# EAGLE design BareBones Arduino No Multiplexer (EAGLE 8.4.1)
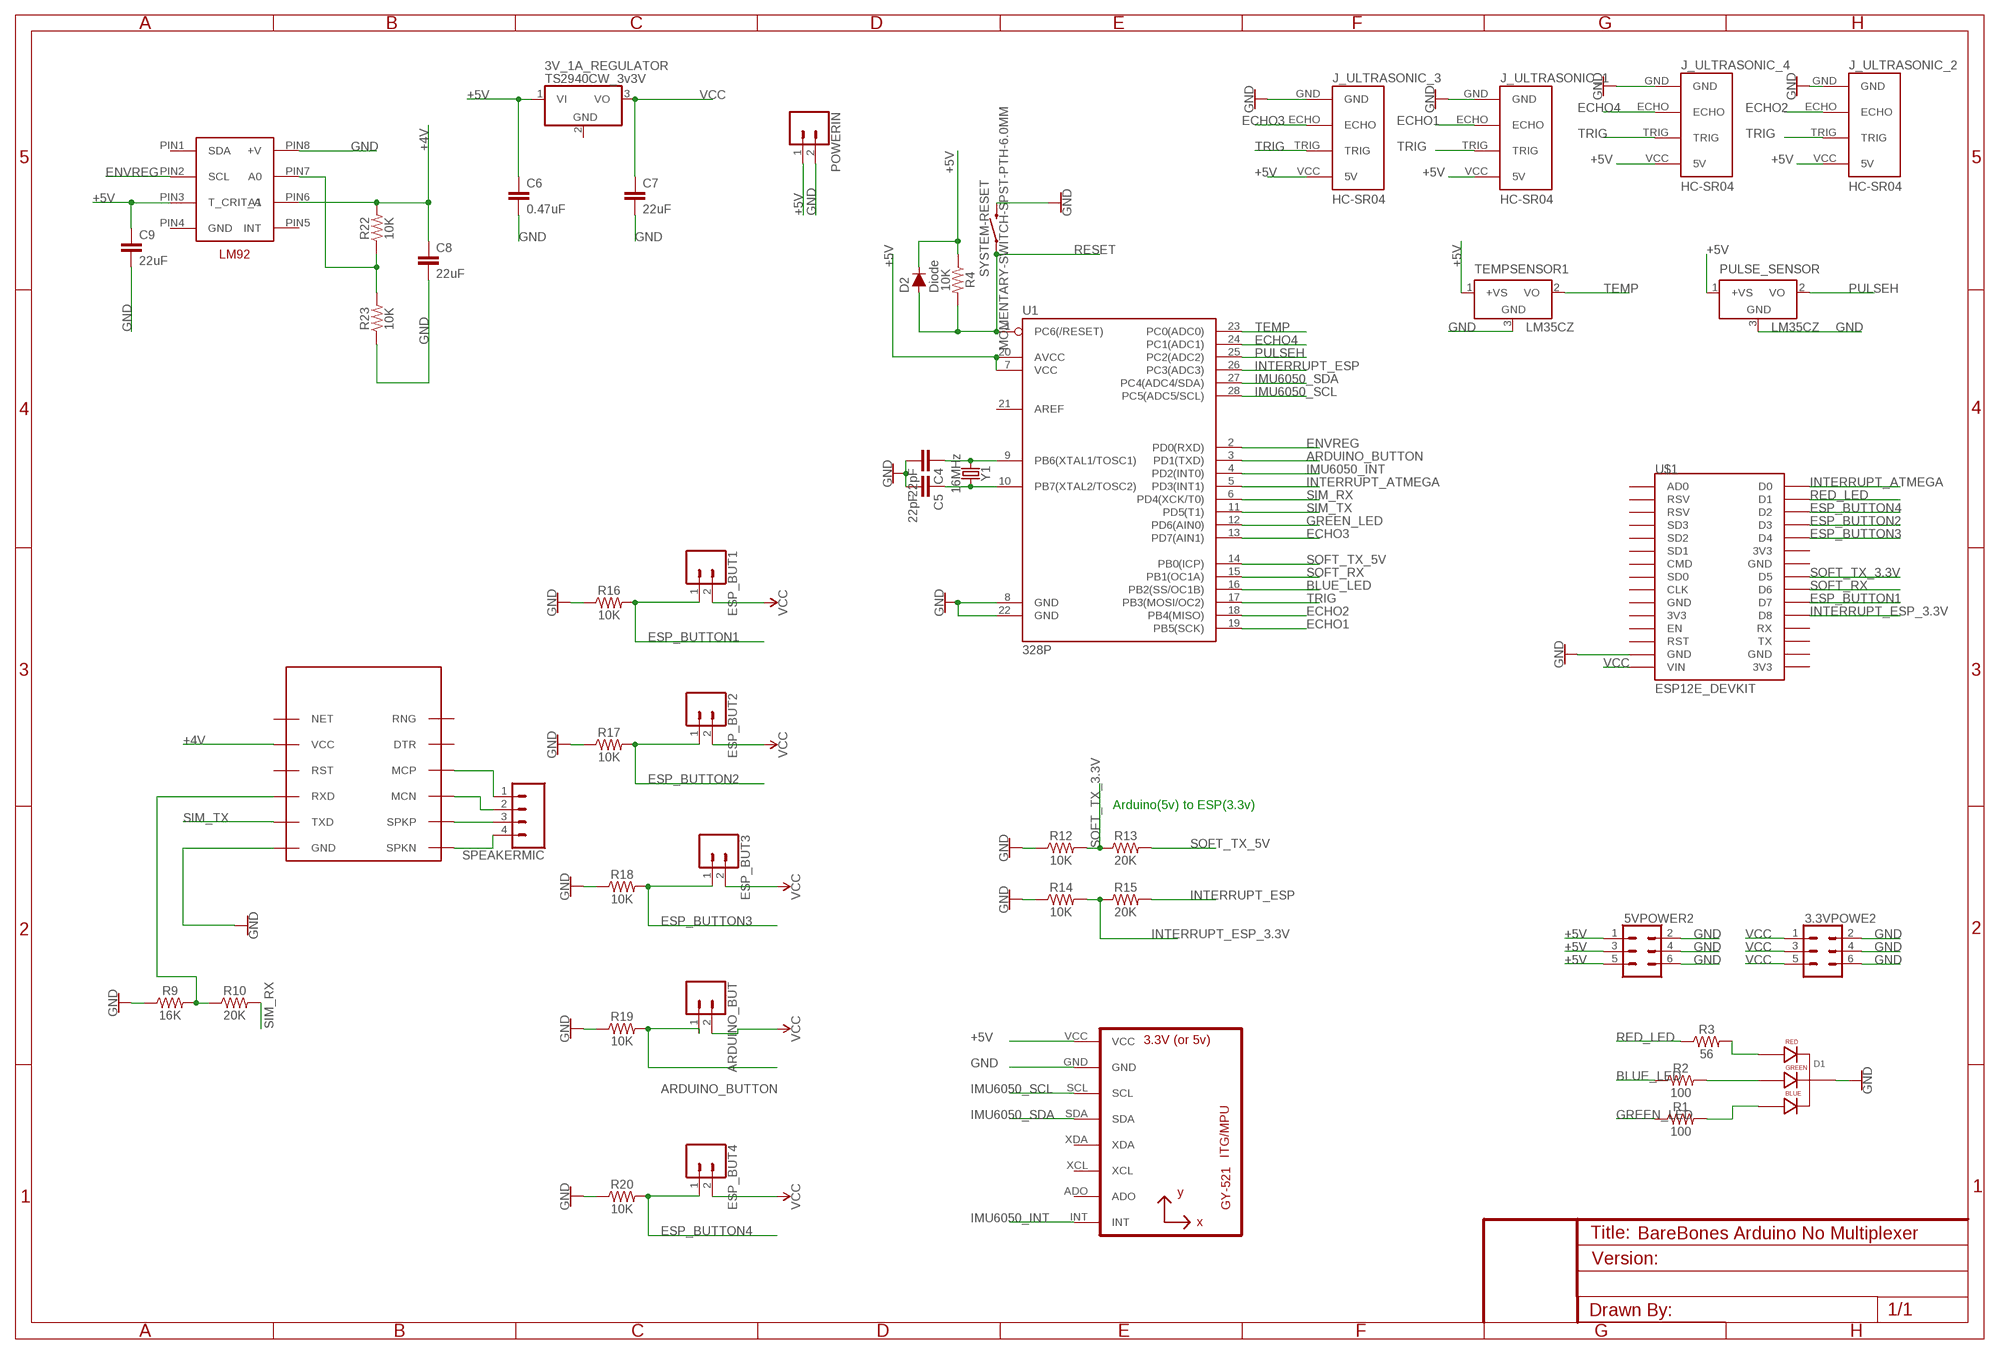
[diagram p0: schematic, sheet 1]

## Parts
3.3VPOWE2  CONN_03X2FEMALE  [2X3]
3V_1A_REGULATOR  TS2940CW_3v3V  MCP1703DB  [SOT223]
5VPOWER2  CONN_03X2FEMALE  [2X3]
ARDUINO_BUT  CONN_02  [1X02]
C4  22pF  22PF-PTH-2.54MM-200V-5%  [CAP-PTH-2.54]
C5  22pF  22PF-PTH-2.54MM-200V-5%  [CAP-PTH-2.54]
C6  0.47uF  0.1UF-KIT-EZ-50V-20%  [CAP-PTH-SMALL-KIT]
C7  22uF  0.1UF-KIT-EZ-50V-20%  [CAP-PTH-SMALL-KIT]
C8  22uF  0.1UF-KIT-EZ-50V-20%  [CAP-PTH-SMALL-KIT]
C9  22uF  0.1UF-KIT-EZ-50V-20%  [CAP-PTH-SMALL-KIT]
D1  LED-RGB-CC-THRUDIFFUSE  [LED-RGB-THRU]
D2  Diode  DIODE-1N4148  [DIODE-1N4148]
ESP_BUT1  CONN_02  [1X02]
ESP_BUT2  CONN_02  [1X02]
ESP_BUT3  CONN_02  [1X02]
ESP_BUT4  CONN_02  [1X02]
J_ULTRASONIC_1  HC-SR04  [HC-SR04_FOOTPRINT]
J_ULTRASONIC_2  HC-SR04  [HC-SR04_FOOTPRINT]
J_ULTRASONIC_3  HC-SR04  [HC-SR04_FOOTPRINT]
J_ULTRASONIC_4  HC-SR04  [HC-SR04_FOOTPRINT]
POWERIN  CONN_025MM  [SCREWTERMINAL-5MM-2]
PULSE_SENSOR  LM35CZ  [TO92]
R1  100  100OHM-HORIZ-1/4W-1%  [AXIAL-0.3]
R2  100  100OHM-HORIZ-1/4W-1%  [AXIAL-0.3]
R3  56  RESISTORAXIAL-0.3  [AXIAL-0.3]
R4  10K  100OHM-HORIZ-1/4W-1%  [AXIAL-0.3]
R9  16K  100OHM-HORIZ-1/4W-1%  [AXIAL-0.3]
R10  20K  100OHM-HORIZ-1/4W-1%  [AXIAL-0.3]
R12  10K  100OHM-HORIZ-1/4W-1%  [AXIAL-0.3]
R13  20K  100OHM-HORIZ-1/4W-1%  [AXIAL-0.3]
R14  10K  100OHM-HORIZ-1/4W-1%  [AXIAL-0.3]
R15  20K  100OHM-HORIZ-1/4W-1%  [AXIAL-0.3]
R16  10K  100OHM-HORIZ-1/4W-1%  [AXIAL-0.3]
R17  10K  100OHM-HORIZ-1/4W-1%  [AXIAL-0.3]
R18  10K  100OHM-HORIZ-1/4W-1%  [AXIAL-0.3]
R19  10K  100OHM-HORIZ-1/4W-1%  [AXIAL-0.3]
R20  10K  100OHM-HORIZ-1/4W-1%  [AXIAL-0.3]
R22  10K  100OHM-HORIZ-1/4W-1%  [AXIAL-0.3]
R23  10K  100OHM-HORIZ-1/4W-1%  [AXIAL-0.3]
SPEAKERMIC  CONN_04  [1X04]
SYSTEM-RESET  MOMENTARY-SWITCH-SPST-PTH-6.0MM  [TACTILE_SWITCH_PTH_6.0MM]
TEMPSENSOR1  LM35CZ  [TO92]
U1  328P  ATMEGA328P_PDIP  [DIP28]
U2  GY-521MPU6050  [GY-521]
U$1  ESP12E_DEVKIT  [ESP12E_DEVKIT]
U$4  SIM800L  [SIM-CORE]
VREG  LM92  [SOP-8]
Y1  16MHz  CRYSTAL-16MHZPTH-HC49US  [HC49US]

## Nets
+4V: C8.1 R22.P$2 U$4.VCC VREG.PIN6(A1)
+5V: 3V_1A_REGULATOR.1(VI) 5VPOWER2.1 5VPOWER2.3 5VPOWER2.5 C6.1 C9.1 D2.C J_ULTRASONIC_1.VCC(5V) J_ULTRASONIC_2.VCC(5V) J_ULTRASONIC_3.VCC(5V) J_ULTRASONIC_4.VCC(5V) POWERIN.1 PULSE_SENSOR.1(+VS) R4.P$1 TEMPSENSOR1.1(+VS) U1.7(VCC) U1.20(AVCC) U2.VCC VREG.PIN3(T_CRIT_A)
ARDUINO_BUTTON: ARDUINO_BUT.1 R19.P$2 U1.3(PD1(TXD))
BLUE_LED: R2.P$1 U1.16(PB2(SS/OC1B))
ECHO1: J_ULTRASONIC_1.ECHO U1.19(PB5(SCK))
ECHO2: J_ULTRASONIC_2.ECHO U1.18(PB4(MISO))
ECHO3: J_ULTRASONIC_3.ECHO U1.13(PD7(AIN1))
ECHO4: J_ULTRASONIC_4.ECHO U1.24(PC1(ADC1))
ENVREG: U1.2(PD0(RXD)) VREG.PIN2(SCL)
ESP_BUTTON1: ESP_BUT1.1 R16.P$2 U$1.D7
ESP_BUTTON2: ESP_BUT2.1 R17.P$2 U$1.D3
ESP_BUTTON3: ESP_BUT3.1 R18.P$2 U$1.D4
ESP_BUTTON4: ESP_BUT4.1 R20.P$2 U$1.D2
GND: 3.3VPOWE2.2 3.3VPOWE2.4 3.3VPOWE2.6 5VPOWER2.2 5VPOWER2.4 5VPOWER2.6 C4.2 C5.2 C6.2 C7.2 C8.2 C9.2 D1.2(CATHODE) J_ULTRASONIC_1.GND J_ULTRASONIC_2.GND J_ULTRASONIC_3.GND J_ULTRASONIC_4.GND POWERIN.2 PULSE_SENSOR.3(GND) R9.P$1 R12.P$1 R14.P$1 R16.P$1 R17.P$1 R18.P$1 R19.P$1 R20.P$1 R23.P$1 SYSTEM-RESET.3 TEMPSENSOR1.3(GND) U1.8(GND) U1.22(GND) U2.GND U$1.GND@1(GND) U$4.GND VREG.PIN8(+V)
GREEN_LED: R1.P$1 U1.12(PD6(AIN0))
IMU6050_INT: U1.4(PD2(INT0)) U2.INT
IMU6050_SCL: U1.28(PC5(ADC5/SCL)) U2.SCL
IMU6050_SDA: U1.27(PC4(ADC4/SDA)) U2.SDA
INTERRUPT_ATMEGA: U1.5(PD3(INT1)) U$1.D0
INTERRUPT_ESP: R15.P$2 U1.26(PC3(ADC3))
INTERRUPT_ESP_3.3V: R14.P$2 R15.P$1 U$1.D8
N$1: C5.1 U1.10(PB7(XTAL2/TOSC2)) Y1.2
N$2: D1.1(RED_CATHODE) R3.P$2
N$3: D1.3(GREEN_CATHODE) R2.P$2
N$4: D1.4(BLUE_CATHODE) R1.P$2
N$5: SPEAKERMIC.1 U$4.MCP
N$7: SPEAKERMIC.2 U$4.MCN
N$8: C4.1 U1.9(PB6(XTAL1/TOSC1)) Y1.1
N$9: SPEAKERMIC.3 U$4.SPKP
N$10: SPEAKERMIC.4 U$4.SPKN
N$11: R9.P$2 R10.P$1 U$4.RXD
N$16: R22.P$1 R23.P$2 VREG.PIN7(A0)
PULSEH: PULSE_SENSOR.2(VO) U1.25(PC2(ADC2))
RED_LED: R3.P$1 U$1.D1
RESET: D2.A R4.P$2 SYSTEM-RESET.1 U1.1(PC6(/RESET))
SIM_RX: R10.P$2 U1.6(PD4(XCK/T0))
SIM_TX: U1.11(PD5(T1)) U$4.TXD
SOFT_RX: U1.15(PB1(OC1A)) U$1.D6
SOFT_TX_3.3V: R12.P$2 R13.P$1 U$1.D5
SOFT_TX_5V: R13.P$2 U1.14(PB0(ICP))
TEMP: TEMPSENSOR1.2(VO) U1.23(PC0(ADC0))
TRIG: J_ULTRASONIC_1.TRIG J_ULTRASONIC_2.TRIG J_ULTRASONIC_3.TRIG J_ULTRASONIC_4.TRIG U1.17(PB3(MOSI/OC2))
VCC: 3.3VPOWE2.1 3.3VPOWE2.3 3.3VPOWE2.5 3V_1A_REGULATOR.3(VO) ARDUINO_BUT.2 C7.1 ESP_BUT1.2 ESP_BUT2.2 ESP_BUT3.2 ESP_BUT4.2 U$1.VIN
Unconnected: 3V_1A_REGULATOR.2(GND) U1.21(AREF) U2.ADO U2.XCL U2.XDA U$1.3V3@0(3V3) U$1.3V3@1(3V3) U$1.3V3@2(3V3) U$1.AD0 U$1.CLK U$1.CMD U$1.EN U$1.GND@0(GND) U$1.GND@2(GND) U$1.GND@3(GND) U$1.RST U$1.RSV@0(RSV) U$1.RSV@1(RSV) U$1.RX U$1.SD0 U$1.SD1 U$1.SD2 U$1.SD3 U$1.TX U$4.DTR U$4.NET U$4.RNG U$4.RST VREG.PIN1(SDA) VREG.PIN4(GND) VREG.PIN5(INT)

## Notes on the sheet
- Arduino(5v) to ESP(3.3v)

## Library data of the parts
3.3VPOWE2 5VPOWER2 = SparkFun-Connectors:CONN_03X2: Multi connection point. Often used as Generic Header-pin footprint for 0.1 inch spaced/style header connections You can populate with any combo of single row headers, but if you'd like an exact match, check these: Header - 2x3 (Male, 0.1") <https://www.sparkfun.com/products/12807> (PRT-12807) Header - 2x3 (Female, 0.1") <https://www.sparkfun.com/products/13010> (PRT-13010) 2x3 Pin Shrouded Header <https://www.sparkfun.com/products/10877> (PRT-10877) On any of the 0.1 inch spaced packages, you can populate with these: Break Away Headers - Straight <https://www.sparkfun.com/products/116> (PRT-00116) Break Away Male Headers - Right Angle <https://www.sparkfun.com/products/553> (PRT-00553) Female Headers <https://www.sparkfun.com/products/115> (PRT-00115) Break Away Headers - Machine Pin <https://www.sparkfun.com/products/117> (PRT-00117) Break Away Female Headers - Swiss Machine Pin <https://www.sparkfun.com/products/743> (PRT-00743) Special note: the shrouded connector mates well with our 3x2 ribbon cables: Ribbon Crimp Connector - 6-pin (2x3, Female) <https://www.sparkfun.com/products/10651> (PRT-10651) Ribbon Cable - 6 wire (15ft) <https://www.sparkfun.com/products/10646> (PRT-10646); PROD_ID: CONN-11566; VALUE: FEMALE 2x3
3V_1A_REGULATOR = linear:MCP1703: 250 mA, 16V, Low Quiescent Current LDO Regulator Source: http://ww1.microchip.com/downloads/en/DeviceDoc/22049b.pdf
ARDUINO_BUT ESP_BUT1-ESP_BUT4 = SparkFun-Connectors:CONN_02: Multi connection point. Often used as Generic Header-pin footprint for 0.1 inch spaced/style header connections On any of the 0.1 inch spaced packages, you can populate with these: Break Away Headers - Straight <https://www.sparkfun.com/products/116> (PRT-00116) Break Away Male Headers - Right Angle <https://www.sparkfun.com/products/553> (PRT-00553) Female Headers <https://www.sparkfun.com/products/115> (PRT-00115) Break Away Headers - Machine Pin <https://www.sparkfun.com/products/117> (PRT-00117) Break Away Female Headers - Swiss Machine Pin <https://www.sparkfun.com/products/743> (PRT-00743) For SCREWTERMINALS and SPRING TERMINALS visit here: Screw Terimnals on SparkFun.com <https://www.sparkfun.com/search/results?term=Screw+Terminals> (5mm/3.5mm/2.54mm spacing) This device is also useful as a general connection point to wire up your design to another part of your project. Our various solder wires solder well into these plated through hole pads. Hook-Up Wire - Assortment (Stranded, 22 AWG) <https://www.sparkfun.com/products/11375> (PRT-11375) Hook-Up Wire - Assortment (Solid Core, 22 AWG) <https://www.sparkfun.com/products/11367> (PRT-11367) View the entire wire category on our website here <https://www.sparkfun.com/categories/141> Special notes: Molex polarized connector foot print use with: PRT-08233 with associated crimp pins and housings. 2.54_SCREWTERM for use with PRT-10571. 3.5mm Screw Terminal footprints for PRT-08084 5mm Screw Terminal footprints for use with PRT-08432
C4 C5 = SparkFun-Capacitors:22PF: 22pF ceramic capacitors A capacitor is a passive two-terminal electrical component used to store electrical energy temporarily in an electric field.; PROD_ID: CAP-09128
C6-C9 = SparkFun-Capacitors:0.1UF: 0.1µF ceramic capacitors A capacitor is a passive two-terminal electrical component used to store electrical energy temporarily in an electric field.; PROD_ID: CAP-08370; VALUE: 0.1uF
D1 = led:LED-RGB-CC-THRU: RGB Through-hole common cathode LED SparkFun Storefront: COM-00105 (Clear) COM-09264 (Diffuse); PROD_ID: DIO-09434
D2 = SparkFun-DiscreteSemi:DIODE: Diode These are standard reverse protection diodes and small signal diodes. SparkFun Products: SparkFun SparkPunk Sound Kit <https://www.sparkfun.com/products/11177> SparkFun ESP8266 Thing <https://www.sparkfun.com/products/13231>; PROD_ID: DIO-08378; VALUE: 200mA/100V/1V
J_ULTRASONIC_1-J_ULTRASONIC_4 = UltraSonic Sensor:HC-SR04: Ultrasonic Sensor HC-SR04
POWERIN = SparkFun-Connectors:CONN_02: Multi connection point. Often used as Generic Header-pin footprint for 0.1 inch spaced/style header connections On any of the 0.1 inch spaced packages, you can populate with these: Break Away Headers - Straight <https://www.sparkfun.com/products/116> (PRT-00116) Break Away Male Headers - Right Angle <https://www.sparkfun.com/products/553> (PRT-00553) Female Headers <https://www.sparkfun.com/products/115> (PRT-00115) Break Away Headers - Machine Pin <https://www.sparkfun.com/products/117> (PRT-00117) Break Away Female Headers - Swiss Machine Pin <https://www.sparkfun.com/products/743> (PRT-00743) For SCREWTERMINALS and SPRING TERMINALS visit here: Screw Terimnals on SparkFun.com <https://www.sparkfun.com/search/results?term=Screw+Terminals> (5mm/3.5mm/2.54mm spacing) This device is also useful as a general connection point to wire up your design to another part of your project. Our various solder wires solder well into these plated through hole pads. Hook-Up Wire - Assortment (Stranded, 22 AWG) <https://www.sparkfun.com/products/11375> (PRT-11375) Hook-Up Wire - Assortment (Solid Core, 22 AWG) <https://www.sparkfun.com/products/11367> (PRT-11367) View the entire wire category on our website here <https://www.sparkfun.com/categories/141> Special notes: Molex polarized connector foot print use with: PRT-08233 with associated crimp pins and housings. 2.54_SCREWTERM for use with PRT-10571. 3.5mm Screw Terminal footprints for PRT-08084 5mm Screw Terminal footprints for use with PRT-08432; SF_SKU: PRT-08432
PULSE_SENSOR TEMPSENSOR1 = lm35:LM35: Single-Supply Centigrade Temperature Sensor Vout = (10mV/°C x Temp °C) +5mmmV Source: http://www.national.com/ds/LM/LM35.pdf
R1 R2 = SparkFun-Resistors:100OHM: 100Ω resistor A resistor is a passive two-terminal electrical component that implements electrical resistance as a circuit element. Resistors act to reduce current flow, and, at the same time, act to lower voltage levels within circuits. - Wikipedia; PROD_ID: RES-12181
R3 = SparkFun-Resistors:RESISTOR: Generic Resistor Package
R4 R9 R10 R12-R20 R22 R23 = SparkFun-Resistors:100OHM: 100Ω resistor A resistor is a passive two-terminal electrical component that implements electrical resistance as a circuit element. Resistors act to reduce current flow, and, at the same time, act to lower voltage levels within circuits. - Wikipedia; PROD_ID: RES-12181; VALUE: 100
SPEAKERMIC = SparkFun-Connectors:CONN_04: Multi connection point. Often used as Generic Header-pin footprint for 0.1 inch spaced/style header connections On any of the 0.1 inch spaced packages, you can populate with these: Break Away Headers - Straight <https://www.sparkfun.com/products/116> (PRT-00116) Break Away Male Headers - Right Angle <https://www.sparkfun.com/products/553> (PRT-00553) Female Headers <https://www.sparkfun.com/products/115> (PRT-00115) Break Away Headers - Machine Pin <https://www.sparkfun.com/products/117> (PRT-00117) Break Away Female Headers - Swiss Machine Pin <https://www.sparkfun.com/products/743> (PRT-00743) For SCREWTERMINALS and SPRING TERMINALS visit here: Screw Terimnals on SparkFun.com <https://www.sparkfun.com/search/results?term=Screw+Terminals> (5mm/3.5mm/2.54mm spacing) This device is also useful as a general connection point to wire up your design to another part of your project. Our various solder wires solder well into these plated through hole pads. Hook-Up Wire - Assortment (Stranded, 22 AWG) <https://www.sparkfun.com/products/11375> (PRT-11375) Hook-Up Wire - Assortment (Solid Core, 22 AWG) <https://www.sparkfun.com/products/11367> (PRT-11367) View the entire wire category on our website here <https://www.sparkfun.com/categories/141> Special notes: Molex polarized connector foot print use with SKU : PRT-08231 with associated crimp pins and housings. 1MM SMD Version SKU: PRT-10208; PROD_ID: CONN-09696
SYSTEM-RESET = SparkFun-Switches:MOMENTARY-SWITCH-SPST: Momentary Switch (Pushbutton) - SPST Normally-open (NO) SPST momentary switches (buttons, pushbuttons). Variants PTH-12MM - 12mm square, through-hole Momentary Pushbutton Switch - 12mm Square <https://www.sparkfun.com/products/9190> (COM-09190) PTH-6.0MM, PTH-6.0MM-KIT - 6.0mm square, through-hole Mini Pushbutton Switch <https://www.sparkfun.com/products/97> (COM-00097) KIT package intended for soldering kit's - only one side of pads' copper is exposed. PTH-RIGHT-ANGLE-KIT - Right-angle, through-hole Right Angle Tactile Button <https://www.sparkfun.com/products/10791> - Used on SparkFun BigTime Watch Kit <https://www.sparkfun.com/products/11734> SMD-12MM - 12mm square, surface-mount Tactile Button - SMD (12mm) <https://www.sparkfun.com/products/12993> (COM-12993) Used on SparkFun PicoBoard <https://www.sparkfun.com/products/11888> SMD-4.5MM - 4.5mm Square Trackball Switch Used on SparkFun Blackberry Trackballer Breakout <https://www.sparkfun.com/products/13169> SMD-4.6MMX2.8MM - 4.60mm x 2.80mm, surface mount Used on SparkFun SAMD21 Mini Breakout <https://www.sparkfun.com/products/13664> SMD-5.2MM, SMD-5.2-REDUNDANT - 5.2mm square, surface-mount Mini Pushbutton Switch - SMD <https://www.sparkfun.com/products/8720> (COM-08720) Used on Arduino Pro Mini <https://www.sparkfun.com/products/11114> REDUNDANT package connects both switch circuits together SMD-6.0X3.5MM - 6.0 x 3.5mm, surface mount Momentary Reset Switch SMD <https://www.sparkfun.com/products/8229> (COM-08229) SMD-6.2MM-TALL - 6.2mm square, surface mount Tactile Button - SMD (6mm) <https://www.sparkfun.com/products/12992> Used on SparkFun Digital Sandbox <https://www.sparkfun.com/products/12651> SMD-RIGHT-ANGLE - Right-angle, surface mount Used on SparkFun Block for Intel® Edison - Arduino <https://www.sparkfun.com/products/13036>; PROD_ID: SWCH-08441; SF_SKU: COM-00097
U1 = SparkFun-IC-Microcontroller:ATMEGA328P_PDIP: Atmel 328P Through hole ATMEGA328P uC used in the Arduino 32kb flash, 1k EEPROM, 2k SRAM Datasheet <http://www.sparkfun.com/datasheets/Components/SMD/ATMega328.pdf> SparkFun Products Storefront component: AVR 28 Pin 20MHz 32K 6A/D - ATMega328P <https://www.sparkfun.com/products/9061> (COM-09061) SparkFun Simon Says - Through-Hole Soldering Kit <https://www.sparkfun.com/products/10547> (KIT-10547) SparkFun Learn to Solder - Simon Says <https://www.sparkfun.com/products/13708> (KIT-13708) SparkFun BigTime Watch Kit <https://www.sparkfun.com/products/11734> (KIT-11734) SparkFun ClockIt <https://www.sparkfun.com/products/10930> (KIT-10930) SparkFun Serial Enabled LCD Kit <https://www.sparkfun.com/products/10097> (LCD-10097) SparkFun Simon Tilts - Through Hole Soldering Kit <https://www.sparkfun.com/products/12634> (KIT-12634) SparkFun Frequency Counter Kit <https://www.sparkfun.com/products/10140> (KIT-10140) FabFM Radio Kit <https://www.sparkfun.com/products/11043> (KIT-11043) SparkFun Binary Blaster Kit <https://www.sparkfun.com/products/12037> (KIT-12037) SparkFun Metro-Gnome <https://www.sparkfun.com/products/9236> (KIT-09236) ATmega328 with Arduino Optiboot (Uno) <https://www.sparkfun.com/products/10524> (DEV-10524); PROD_ID: IC-09136
U2 = mpu6050:GY-521
U$1 = nodeMCU:ESP12E_DEVKIT: ESP12E DEVKIT BOARD
U$4 = SIM800L2:SIM800L
VREG = smdfootprint:LM92; SPICEPREFIX: X
Y1 = SparkFun-Clocks:CRYSTAL-16MHZ: 16MHz Crystal Digikey Example <http://www.digikey.com/product-search/en?keywords=535-9122-1-ND> Frequency: 16MHz Frequency Stability: ±50ppm Frequency Tolerance: ±20ppm Load Capacitance: 18pF SparkFun Products: Pro Micro -5V/16MHz <https://www.sparkfun.com/products/12640> SparkFun Serial Enabled LCD Kit <https://www.sparkfun.com/products/10097>; PROD_ID: XTAL-08181; SF_ID: COM-00536

## Board
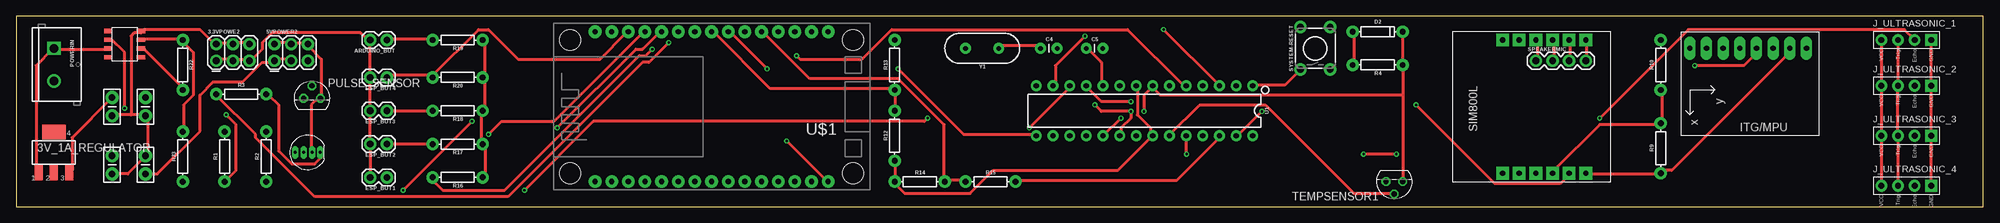
[diagram p1: board, top side]
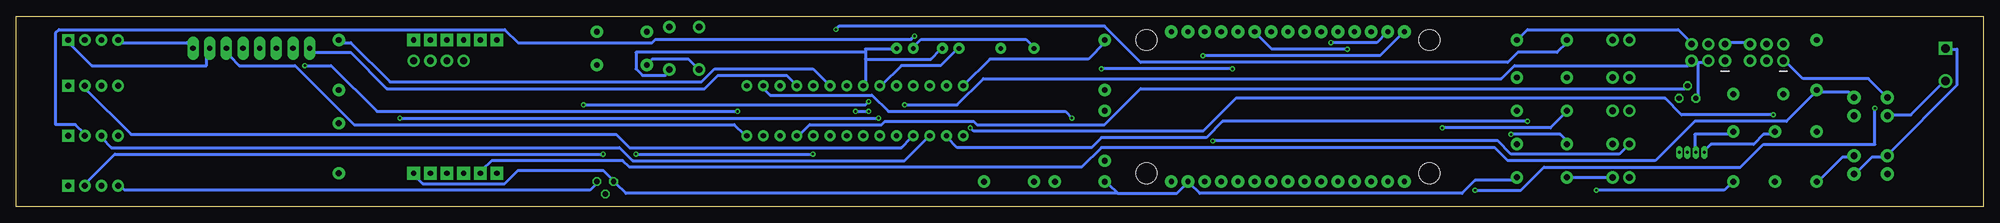
[diagram p2: board, bottom side, seen from below]

Size 300 x 29 mm. Coordinates in mm from the lower left corner, seen from the top.
Outline: 0,0 300,0 300,29 0,29 0,0
Copper layers (1*16): Top 0.035mm / dielectric 1.5mm / Bottom 0.035mm
Design rules "default *": minimum track width 18mil, minimum drill 0.35mm, track to track 12mil, track to pad 12mil, pad to pad 12mil, via to via 12mil, smd to smd 6mil, copper to edge 40mil, drill to drill 6mil, minimum pad ring 10mil, minimum via ring 8mil, stop-mask expansion 4mil, vias tented up to drill 0mil, thermal gap 10mil

### Footprints (pad centres in the part's own frame; a part is rotated, then mirrored left to right if it is on the bottom)
2X3 = drill 1.016 pad 1.88: 1 0,0; 2 0,2.54; 3 2.54,0; 4 2.54,2.54; 5 5.08,0; 6 5.08,2.54
SOT223 = smd 1.219 x 2.235: 1 -2.311,-3.099; 2 0,-3.099; 3 2.311,-3.099 | smd 3.6 x 2.2: 4 0,3.099
1X02 = drill 1.016 pad 1.88: 1 0,0; 2 2.54,0
CAP-PTH-2.54 = drill 0.7 pad 1.651: 1 -1.27,0; 2 1.27,0
CAP-PTH-SMALL-KIT = drill 1.016 pad 2.032: 1 -1.397,0; 2 1.397,0
LED-RGB-THRU = drill 0.45 pad 0.5 long: 1 1.905,0; 2 0.635,0; 3 -0.635,0; 4 -1.905,0
DIODE-1N4148 = drill 0.9 pad 1.88: A -3.81,0; C 3.81,0
HC-SR04_FOOTPRINT = drill 0.9 pad 1.778: ECHO 0,1.27; TRIG 0,-1.27; VCC 0,-3.81 | drill 0.9 pad 1.778 square: GND 0,3.81
SCREWTERMINAL-5MM-2 = drill 1.3 pad 2.032 square: 1 0,0 | drill 1.3 pad 2.032: 2 5,0
TO92 = drill 0.813 octagon: 1 -1.27,0; 2 0,1.905; 3 1.27,0
AXIAL-0.3 = drill 0.9 pad 1.88: P$1 -3.81,0; P$2 3.81,0
1X04 = drill 1.016 pad 1.88: 1 0,0; 2 2.54,0; 3 5.08,0; 4 7.62,0
TACTILE_SWITCH_PTH_6.0MM = drill 1.016 pad 1.88: 1 -3.251,2.261; 2 3.251,2.261; 3 -3.251,-2.261; 4 3.251,-2.261
DIP28 = drill 0.813 pad 1.626: 1 -16.51,-3.81; 2 -13.97,-3.81; 3 -11.43,-3.81; 4 -8.89,-3.81; 5 -6.35,-3.81; 6 -3.81,-3.81; 7 -1.27,-3.81; 8 1.27,-3.81; 9 3.81,-3.81; 10 6.35,-3.81; 11 8.89,-3.81; 12 11.43,-3.81; 13 13.97,-3.81; 14 16.51,-3.81; 15 16.51,3.81; 16 13.97,3.81; 17 11.43,3.81; 18 8.89,3.81; 19 6.35,3.81; 20 3.81,3.81; 21 1.27,3.81; 22 -1.27,3.81; 23 -3.81,3.81; 24 -6.35,3.81; 25 -8.89,3.81; 26 -11.43,3.81; 27 -13.97,3.81; 28 -16.51,3.81
GY-521 = drill 0.8 pad 1.778 long: ADO -8.89,-6.35; GND -8.89,6.35; INT -8.89,-8.89; SCL -8.89,3.81; SDA -8.89,1.27; VCC -8.89,8.89; XCL -8.89,-3.81; XDA -8.89,-1.27
ESP12E_DEVKIT = drill 0.8 pad 1.93: 3V3@0 -11.43,-7.62; 3V3@1 11.43,5.08; 3V3@2 11.43,-17.78; AD0 -11.43,17.78; CLK -11.43,-2.54; CMD -11.43,2.54; D0 11.43,17.78; D1 11.43,15.24; D2 11.43,12.7; D3 11.43,10.16; D4 11.43,7.62; D5 11.43,0; D6 11.43,-2.54; D7 11.43,-5.08; D8 11.43,-7.62; EN -11.43,-10.16; GND@0 -11.43,-5.08; GND@1 -11.43,-15.24; GND@2 11.43,2.54; GND@3 11.43,-15.24; RST -11.43,-12.7; RSV@0 -11.43,15.24; RSV@1 -11.43,12.7; RX 11.43,-10.16; SD0 -11.43,0; SD1 -11.43,5.08; SD2 -11.43,7.62; SD3 -11.43,10.16; TX 11.43,-12.7; VIN -11.43,-17.78 | hole 3.2: -10.16,21.59; 10.16,21.59; 10.16,-21.59; -10.16,-21.59
SIM-CORE = drill 0.8 pad 1.93 square: DTR 21.59,13.97; GND 1.27,3.81; MCN 21.59,8.89; MCP 21.59,11.43; NET 1.27,16.51; RNG 21.59,16.51; RST 1.27,11.43; RXD 1.27,8.89; SPKN 21.59,3.81; SPKP 21.59,6.35; TXD 1.27,6.35; VCC 1.27,13.97
SOP-8 = smd 1.27 x 0.635: PIN1 -2.5,2; PIN2 -2.5,0.67; PIN3 -2.5,-0.67; PIN4 -2.5,-2; PIN5 2.5,-2; PIN6 2.5,-0.67; PIN7 2.5,0.67; PIN8 2.5,2
HC49US = drill 0.7 pad 1.651: 1 -2.54,0; 2 2.54,0

### Placement (x,y rotation side)
3.3VPOWE2  30.48,22.23 0 top
3V_1A_REGULATOR  5.71,8.26 0 top
5VPOWER2  39.37,22.23 0 top
ARDUINO_BUT  56.52,25.4 180 top
C4  157.48,24.13 0 top
C5  164.47,24.13 0 top
C6  14.61,6.35 270 top
C7  14.61,15.24 270 top
C8  19.68,15.24 270 top
C9  19.68,6.35 90 top
D1  44.45,8.26 0 top
D2  207.65,26.67 0 top
ESP_BUT1  56.52,4.45 180 top
ESP_BUT2  56.52,9.53 180 top
ESP_BUT3  56.52,14.61 180 top
ESP_BUT4  56.52,19.68 180 top
J_ULTRASONIC_1  288.29,25.4 270 top
J_ULTRASONIC_2  288.29,18.41 270 top
J_ULTRASONIC_3  288.29,10.79 270 top
J_ULTRASONIC_4  288.29,3.17 270 top
POWERIN  5.71,24.13 270 top
PULSE_SENSOR  45.09,16.51 0 top
R1  31.75,7.62 90 top
R2  38.1,7.62 90 top
R3  34.29,17.14 0 top
R4  207.65,21.59 180 top
R9  250.82,8.89 90 top
R10  250.82,21.59 90 top
R12  133.99,10.79 90 top
R13  133.99,21.59 90 top
R14  137.79,3.81 0 top
R15  148.59,3.81 0 top
R16  67.31,4.45 180 top
R17  67.31,9.53 180 top
R18  67.31,14.61 180 top
R19  67.31,25.4 180 top
R20  67.31,19.68 180 top
R22  25.4,21.59 270 top
R23  25.4,7.62 90 top
SPEAKERMIC  231.78,22.23 0 top
SYSTEM-RESET  198.12,24.13 90 top
TEMPSENSOR1  210.19,3.81 180 top
U1  172.09,14.61 180 top
U2  264.16,15.24 270 top
U$1  106.05,15.24 90 top
U$4  243.21,3.81 90 top
VREG  16.51,24.77 0 top
Y1  147.32,24.13 180 top

### Tracks (layer width: path | path; a pad name or v marks a point on that pad's centre or on a via)
+4V
  Top 0.457: VREG.PIN6 19.5,24 25.5,18 R22.P$2
  Bottom 0.457: U$4.VCC 229,5.5 227.5,7 207.5,7 206.5,6 137.5,6 134.5,9 74.5,9 72.5,7 50,7 44,13 30,13 25.5,17.5 R22.P$2 25,17.5 20.5,17.5 20,17 C8.1
+5V  (via drill 0.35)
  Top 0.457: 5VPOWER2.3 41.5,22.5 39.5,22.5 5VPOWER2.1 39,22 37.5,22 34.5,19 30,19 28,17 28,11.5 21.5,5 20,5 C9.1 | VREG.PIN3 14,24 6,24 POWERIN.1 5.5,24 3,21.5 3,5.5 3V_1A_REGULATOR.1 | J_ULTRASONIC_4.VCC 284.5,3.5 284.5,10.5 J_ULTRASONIC_3.VCC 284.5,11 284.5,18 J_ULTRASONIC_2.VCC 284.5,18.5 284.5,25 J_ULTRASONIC_1.VCC | v172,14.5 172,17 173,18 U1.7 173.5,18 174.5,17 211.5,17 | U1.20 168.5,11 168.5,12 170,13.5 v170,14.5 165.5,14.5 v164.5,15.5 | 211.5,17 211.5,21.5 R4.P$1 211.5,22 211.5,26.5 D2.C | 211.5,17 211.5,4 TEMPSENSOR1.1
  Bottom 0.457: 43.5,22 43.5,17 PULSE_SENSOR.1 | 43.5,22 44,22 5VPOWER2.5 44.5,22 45,21.5 71.5,21.5 73.5,19.5 152.5,19.5 156.5,15.5 v164.5,15.5 | 43.5,22 42,22 5VPOWER2.3 | C9.1 19.5,5 17,7.5 15,7.5 C6.1 14.5,8 4,18.5 4,24 5.5,24 POWERIN.1 | U2.VCC 273.5,24.5 274,25 284,25 J_ULTRASONIC_1.VCC | v172,14.5 v170,14.5 | J_ULTRASONIC_4.VCC 284,3 283.5,2.5 212.5,2.5 211.5,3.5 TEMPSENSOR1.1
ARDUINO_BUTTON  (via drill 0.35)
  Top 0.457: v175,27 183.5,18.5 U1.3 | ARDUINO_BUT.1 57,25.5 63.5,25.5 R19.P$2
  Bottom 0.457: v175,27 174.5,27.5 134,27.5 128.5,22 72.5,22 71,23.5 65,23.5 63.5,25 R19.P$2
BLUE_LED  (via drill 0.35)
  Top 0.457: v59,2.5 v69.5,13
  Bottom 0.457: v69.5,13 116,13 118.5,10.5 134.5,10.5 136,9 156.5,9 158,10.5 U1.16 | v59,2.5 39.5,2.5 38.5,3.5 R2.P$1
ECHO1  (via drill 0.35)
  Top 0.457: v168.5,13.5 166,11 U1.19 | v241.5,13.5 255,27 288,27 289.5,25.5 J_ULTRASONIC_1.ECHO
  Bottom 0.457: v241.5,13.5 v168.5,13.5
ECHO2
  Bottom 0.457: U1.18 163.5,10.5 165,9 206.5,9 208.5,11 282.5,11 289.5,18 J_ULTRASONIC_2.ECHO
ECHO3  (via drill 0.35)
  Top 0.457: v163,26 158.5,21.5 158.5,18.5 U1.13
  Bottom 0.457: v163,26 163.5,25.5 202.5,25.5 203,25 223.5,25 225.5,27 293.5,27 294,26.5 294,12.5 291,12.5 289.5,11 J_ULTRASONIC_3.ECHO
ECHO4  (via drill 0.35)
  Top 0.457: v178.5,8 178.5,10.5 U1.24 | v210.5,8 v205.5,8
  Bottom 0.457: v205.5,8 v178.5,8 | v210.5,8 285,8 289.5,3.5 J_ULTRASONIC_4.ECHO
ENVREG  (via drill 0.35)
  Top 0.457: v16.5,15 16.5,23.5 14.5,25.5 VREG.PIN2 | v77.5,2.5 88,13 138.5,13 v139,13.5
  Bottom 0.457: v16.5,15 16.5,9.5 33.5,9.5 37,6 67,6 70.5,2.5 v77.5,2.5 | v139,13.5 140,14.5 167,14.5 169.5,17 185,17 186,18 U1.2
ESP_BUTTON1  (via drill 0.35)
  Top 0.457: v97,24 96,23 95,23 74.5,2.5 65,2.5 63.5,4 R16.P$2
  Bottom 0.457: ESP_BUT1.1 57,4.5 63.5,4.5 R16.P$2 | v97,24 108.5,24 111,26.5 U$1.D7
ESP_BUTTON2  (via drill 0.35)
  Top 0.457: ESP_BUT2.1 57,9.5 63.5,9.5 R17.P$2 | v72,11 74,13 82,13 95.5,26.5 U$1.D3
  Bottom 0.457: v72,11 64.5,11 63.5,10 R17.P$2
ESP_BUTTON3  (via drill 0.35)
  Top 0.457: ESP_BUT3.1 57,14.5 63.5,14.5 R18.P$2 | v82.5,12 94.5,24 95.5,24 98,26.5 U$1.D4
  Bottom 0.457: v82.5,12 66,12 63.5,14.5 R18.P$2
ESP_BUTTON4
  Top 0.457: 63.5,20 57,20 ESP_BUT4.1 | 63.5,20 70.5,27 72,27 76.5,22.5 89,22.5 93,26.5 U$1.D2 | 63.5,20 R20.P$2
GND
  Top 0.457: U$4.GND 239.5,5 250.5,5 R9.P$1 251,5.5 252.5,5.5 271,24 U2.GND | J_ULTRASONIC_4.GND 292,3.5 292,10.5 J_ULTRASONIC_3.GND 292,11 292,18 J_ULTRASONIC_2.GND 292,18.5 292,25 J_ULTRASONIC_1.GND | C6.2 15,5 17,5 19.5,7.5 C9.2 20,8 20,13.5 C8.2 19.5,14 17.5,14 | 17.5,14 15,14 C7.2 | D1.2 45,8.5 45,15.5 46,16.5 PULSE_SENSOR.3 46.5,17 46.5,22.5 44.5,24.5 5VPOWER2.6 44,25 42,25 5VPOWER2.4 41.5,25 39.5,25 5VPOWER2.2 | 3.3VPOWE2.6 35.5,25 33.5,25 3.3VPOWE2.4 33,25 30.5,25 3.3VPOWE2.2 30,25 28,27 19.5,27 VREG.PIN8 19,26.5 18,26.5 17.5,26 17.5,14 | U1.8 171,18 171,14 173,12 173,11 U1.22 173,10.5 168,5.5 149,5.5 145.5,2 135.5,2 134,3.5 R14.P$1 134,4 134,6.5 R12.P$1 | R16.P$1 71.5,4.5 71.5,9.5 R17.P$1 71,10 71,14.5 R18.P$1 71.5,15 71.5,19.5 R20.P$1 71.5,20 71.5,25 R19.P$1
  Bottom 0.457: U$4.GND 239.5,5 238,3.5 225.5,3.5 223.5,5.5 210.5,5.5 209,4 TEMPSENSOR1.3 208.5,3.5 207,2 132,2 | U2.GND 271,24 271,21.5 288.5,21.5 292,25 J_ULTRASONIC_1.GND | R23.P$1 25,4 21.5,7.5 20,7.5 C9.2 | POWERIN.2 6,19 11,14 14.5,14 C7.2 | 5VPOWER2.2 39,25 36,25 3.3VPOWE2.6 | 170.5,23.5 170.5,24 166,24 C5.2 | 170.5,23.5 170.5,22.5 | 170.5,22.5 170.5,18.5 U1.8 | 170.5,22.5 160.5,22.5 159,24 C4.2 | 170.5,23.5 205.5,23.5 205.5,21 204.5,20 201,20 200.5,20.5 SYSTEM-RESET.3 | 132,2 123,2 121.5,3.5 U$1.GND@1 121,3.5 119.5,2 79.5,2 77.5,4 71.5,4 R16.P$1 | 132,2 133.5,3.5 R14.P$1 | 5VPOWER2.6 44.5,25 46.5,27 69.5,27 71,25.5 R19.P$1
GREEN_LED  (via drill 0.35)
  Top 0.457: v154.5,12 160.5,18 U1.12 | v32,14 33.5,12.5 33.5,5.5 32,4 R1.P$1
  Bottom 0.457: v154.5,12 154,11.5 119,11.5 114,16.5 48.5,16.5 46,14 v32,14
IMU6050_INT
  Bottom 0.457: U1.4 181,18.5 182.5,20 193,20 195,18 243.5,18 249,23.5 254.5,23.5 255,24 U2.INT
IMU6050_SCL
  Bottom 0.457: U1.28 189,11 190.5,12.5 248.5,12.5 257.5,21.5 266,21.5 267.5,23 267.5,24 U2.SCL
IMU6050_SDA  (via drill 0.35)
  Top 0.457: v190,14.5 186.5,11 U1.27 | v256,21.5 263.5,21.5 265,23 265,24 U2.SDA
  Bottom 0.457: v190,14.5 245,14.5 252,21.5 v256,21.5
INTERRUPT_ATMEGA  (via drill 0.35)
  Top 0.457: v119,23 119.5,22.5 129,22.5 133.5,27 169.5,27 178,18.5 U1.5
  Bottom 0.457: v119,23 92,23 88.5,26.5 U$1.D0
INTERRUPT_ESP
  Top 0.457: U1.26 183.5,10.5 177,4 152.5,4 R15.P$2
INTERRUPT_ESP_3.3V
  Top 0.457: R15.P$1 144.5,4 142,4 R14.P$2 141.5,4 141.5,12.5 134.5,19.5 121,19.5 114,26.5 U$1.D8
N$1
  Top 0.457: U1.10 165.5,18.5 165.5,22 163.5,24 C5.1
  Bottom 0.457: Y1.2 145,24.5 146,25.5 162,25.5 163,24.5 C5.1
N$2
  Top 0.457: D1.1 46.5,8 46.5,7.5 45.5,6.5 42,6.5 40,8.5 40,15.5 38.5,17 R3.P$2
N$3
  Bottom 0.457: D1.3 44,8.5 44,11 38.5,11 R2.P$2
N$4
  Bottom 0.457: D1.4 42.5,8.5 41.5,9.5 35,9.5 33.5,11 32,11 R1.P$2
N$5
  Top 0.457: SPEAKERMIC.1 232,22.5 232,25 U$4.MCP
N$7
  Top 0.457: SPEAKERMIC.2 234.5,22.5 234.5,25 U$4.MCN
N$8
  Top 0.457: Y1.1 150,24.5 156,24.5 C4.1
  Bottom 0.457: U1.9 168,18.5 165,21.5 159,21.5 156.5,24 C4.1
N$9
  Top 0.457: SPEAKERMIC.3 237,22.5 237,25 U$4.SPKP
N$10
  Top 0.457: SPEAKERMIC.4 239.5,22.5 239.5,25 U$4.SPKN
N$11
  Top 0.457: R10.P$1 251,17.5 251,13 R9.P$2 250.5,12.5 241.5,12.5 234.5,5.5 U$4.RXD
N$16
  Top 0.457: VREG.PIN7 19.5,25.5 25,25.5 R22.P$1 25.5,25 27,23.5 27,17 25.5,15.5 25.5,11.5 R23.P$2
PULSEH
  Bottom 0.457: PULSE_SENSOR.2 45.5,18 128.5,18 134,12.5 153.5,12.5 154,13 167.5,13 168,12.5 179,12.5 180.5,11 U1.25
RED_LED  (via drill 0.35)
  Top 0.457: v99.5,25 96.5,22 95.5,22 75,1.5 45.5,1.5 36.5,10.5 36.5,11 30.5,17 R3.P$1
  Bottom 0.457: v99.5,25 92.5,25 91,26.5 U$1.D1
RESET
  Top 0.457: R4.P$2 204,22 204,26.5 D2.A | U1.1 189,18.5 193.5,18.5 195.5,20.5 SYSTEM-RESET.1
  Bottom 0.457: R4.P$2 203.5,22 203,22.5 197.5,22.5 196,21 SYSTEM-RESET.1
SIM_RX
  Bottom 0.457: U1.6 176,18.5 178.5,21 193.5,21 195.5,19 243,19 249,25 250.5,25 R10.P$2
SIM_TX  (via drill 0.35)
  Top 0.457: v170,16 165.5,16 163.5,18 U1.11 | v213.5,15.5 225.5,3.5 235.5,3.5 237,5 U$4.TXD
  Bottom 0.457: v170,16 170.5,15.5 v213.5,15.5
SOFT_RX  (via drill 0.35)
  Top 0.457: v134.5,21 144.5,11 155.5,11 U1.15 | v114.5,21 109,26.5 U$1.D6
  Bottom 0.457: v114.5,21 v134.5,21
SOFT_TX_3.3V
  Top 0.457: R12.P$2 134,15 134,17.5 R13.P$1 133.5,18 115,18 106.5,26.5 U$1.D5
SOFT_TX_5V
  Bottom 0.457: U1.14 155.5,18.5 151.5,22.5 136.5,22.5 134,25 R13.P$2
TEMP
  Top 0.457: TEMPSENSOR1.2 210,2 204,2 190.5,15.5 180.5,15.5 176,11 U1.23
TRIG
  Top 0.457: J_ULTRASONIC_1.TRIG 287,25 287,18.5 J_ULTRASONIC_2.TRIG 287,18 287,11 J_ULTRASONIC_3.TRIG 287,10.5 287,3.5 J_ULTRASONIC_4.TRIG
  Bottom 0.457: U1.17 161,10.5 164.5,7 206,7 208,9 285.5,9 287,10.5 J_ULTRASONIC_3.TRIG
VCC  (via drill 0.35)
  Top 0.457: 3.3VPOWE2.1 30.5,22.5 33,22.5 3.3VPOWE2.3 33.5,22.5 35.5,22.5 3.3VPOWE2.5 36,22.5 37.5,24 37.5,25 39,26.5 52.5,26.5 53.5,25.5 ARDUINO_BUT.2 54,25 54,20 ESP_BUT4.2 54,19.5 54,15 ESP_BUT3.2 54,14.5 54,10 ESP_BUT2.2 54,9.5 54,4.5 ESP_BUT1.2 | 3V_1A_REGULATOR.3 8.5,5.5 8.5,10.5 14.5,16.5 C7.1 | v117.5,10 123.5,4 U$1.VIN
  Bottom 0.457: 3.3VPOWE2.1 30,22 27.5,19.5 17.5,19.5 15,17 C7.1 | v117.5,10 74,10 72,8 55.5,8 ESP_BUT2.2